# EAGLE design V6.0 (EAGLE 7.6.0)
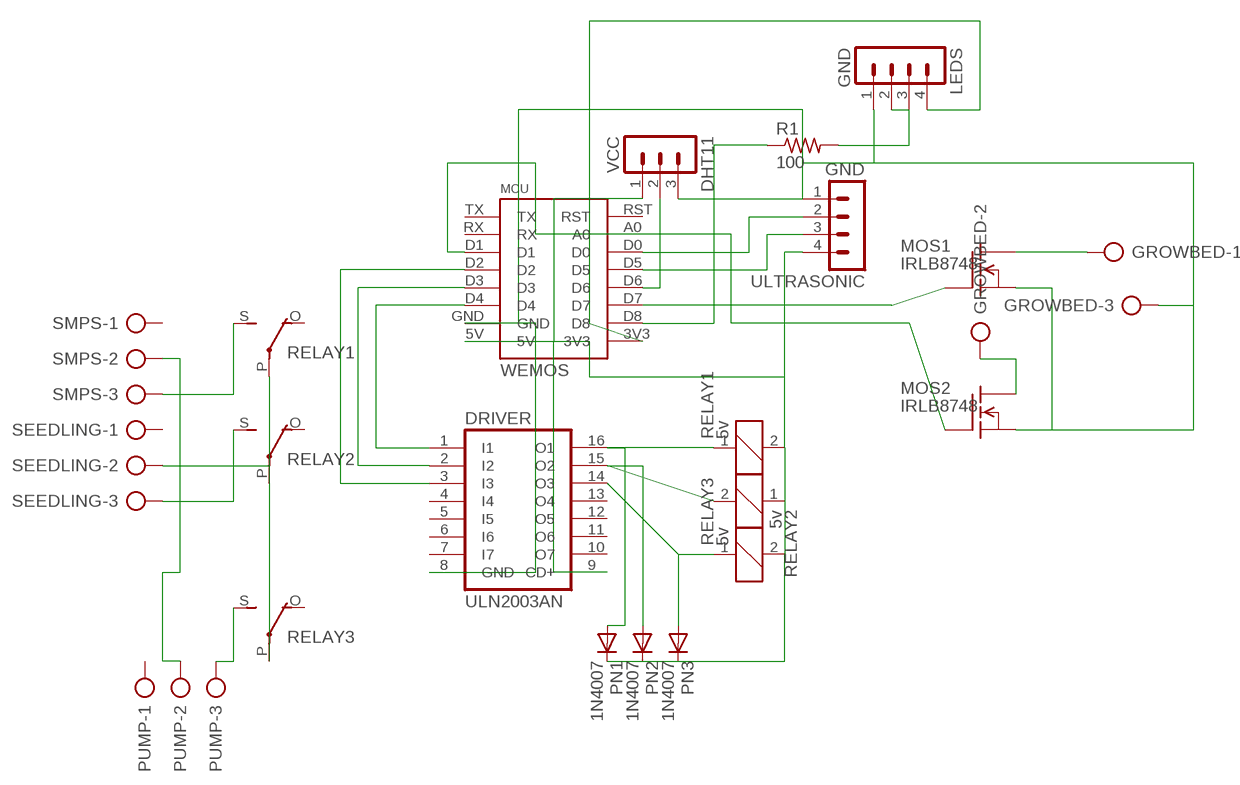
[diagram p0: schematic, sheet 1]

## Parts
DHT11  VCC  MA03-1  [MA03-1]
DRIVER  ULN2003AN  [DIL16]
GROWBED  AK300/3  [AK300/3]
LEDS  GND  MA04-1  [MA04-1]
MCU  WEMOS  [WEMOS]
MOS1  IRLB8748  IRF540  [TO220]
MOS2  IRLB8748  IRF540  [TO220]
PN1  1N4007  1N4004  [DO41-10]
PN2  1N4007  1N4004  [DO41-10]
PN3  1N4007  1N4004  [DO41-10]
PUMP  AK300/3  [AK300/3]
R1  100  R-US_0207/7  [0207/7]
RELAY1  5v  ZF112  [ZF112]
RELAY2  5v  ZF112  [ZF112]
RELAY3  5v  ZF112  [ZF112]
SEEDLING  AK300/3  [AK300/3]
SMPS  AK300/3  [AK300/3]
ULTRASONIC  GND  MA04-1  [MA04-1]

## Nets
N$1: MCU.D5 ULTRASONIC.3
N$2: DRIVER.3(I3) MCU.D2
N$3: DRIVER.2(I2) MCU.D3
N$4: DRIVER.1(I1) MCU.D4
N$5: DHT11.3 DRIVER.8(GND) GROWBED.3 LEDS.1 MCU.GND MOS1.3(S) MOS2.3(S) ULTRASONIC.1
N$6: DHT11.1 DRIVER.9(CD+) MCU.5V PN1.C PN2.C PN3.C RELAY1.2 RELAY2.1 RELAY3.2 ULTRASONIC.4
N$7: DRIVER.15(O2) PN2.A RELAY2.2
N$8: DHT11.2 MCU.D6
N$9: DRIVER.14(O3) PN3.A RELAY3.1
N$10: DRIVER.16(O1) PN1.A RELAY1.1
N$12: RELAY1.S(2:S) SMPS.3
N$13: RELAY2.S(2:S) SEEDLING.3
N$15: PUMP.3 RELAY3.S(2:S)
N$16: PUMP.2 RELAY1.P(2:P) RELAY2.P(2:P) RELAY3.P(2:P) SEEDLING.2 SMPS.2
N$19: MCU.D0 ULTRASONIC.2
N$20: LEDS.4 MCU.3V3
N$21: MCU.D7 MOS1.1(G)
N$22: MCU.D1 MOS2.1(G)
N$24: GROWBED.1 MOS1.2(D)
N$25: GROWBED.2 MOS2.2(D)
N$27: LEDS.2 LEDS.3 R1.2
N$28: MCU.D8 R1.1
Unconnected: DRIVER.4(I4) DRIVER.5(I5) DRIVER.6(I6) DRIVER.7(I7) DRIVER.10(O7) DRIVER.11(O6) DRIVER.12(O5) DRIVER.13(O4) MCU.A0 MCU.RST MCU.RX MCU.TX PUMP.1 RELAY1.O(2:O) RELAY2.O(2:O) RELAY3.O(2:O) SEEDLING.1 SMPS.1

## Library data of the parts
DHT11 = con-lstb:MA03-1: PIN HEADER; OC_FARNELL: unknown; OC_NEWARK: unknown
DRIVER = uln-udn:ULN2003A: DRIVER ARRAY
GROWBED PUMP SEEDLING SMPS = con-ptr500:AK300/3: CONNECTOR; OC_FARNELL: unknown; OC_NEWARK: unknown
LEDS ULTRASONIC = con-lstb:MA04-1: PIN HEADER; OC_FARNELL: unknown; OC_NEWARK: unknown
MCU = Wemos:WEMOS
MOS1 MOS2 = transistor-fet:IRF540: N-Channel Enhancement MOSFET (HEXFET); 100V; 28A; 0,077Ohm
PN1-PN3 = diode:1N4004: DIODE general purpose rectifier, 1 A
R1 = rcl:R-US_: RESISTOR, American symbol
RELAY1-RELAY3 = relay:ZF112: RELAY 1 x switch; OC_FARNELL: unknown; OC_NEWARK: unknown

## Board
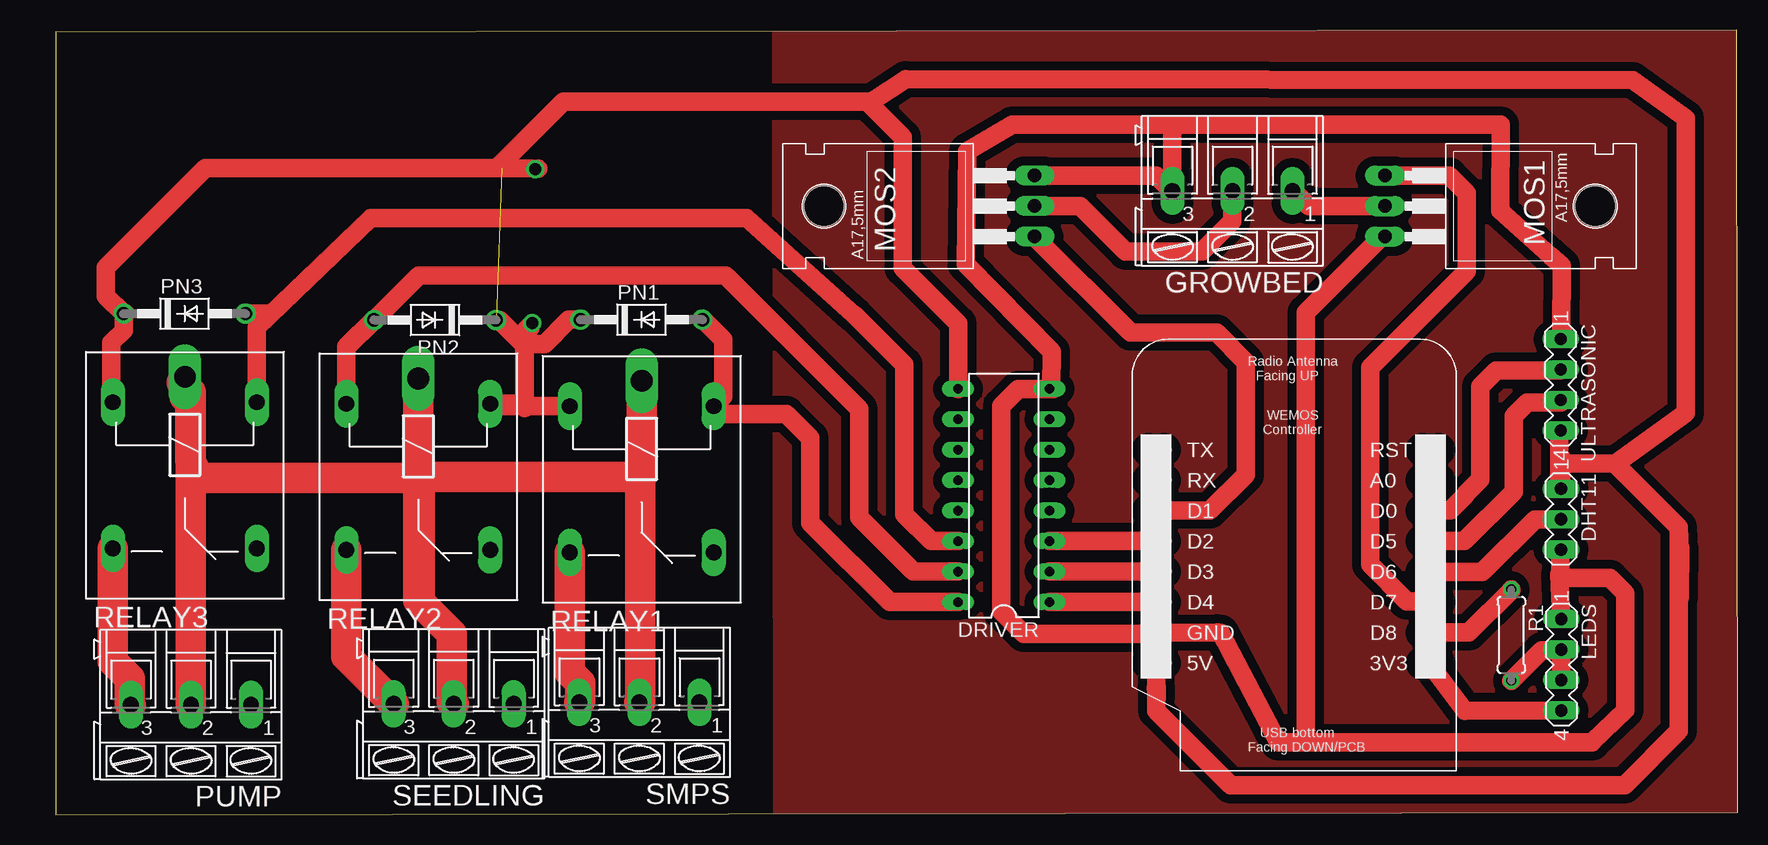
[diagram p1: board, top side]
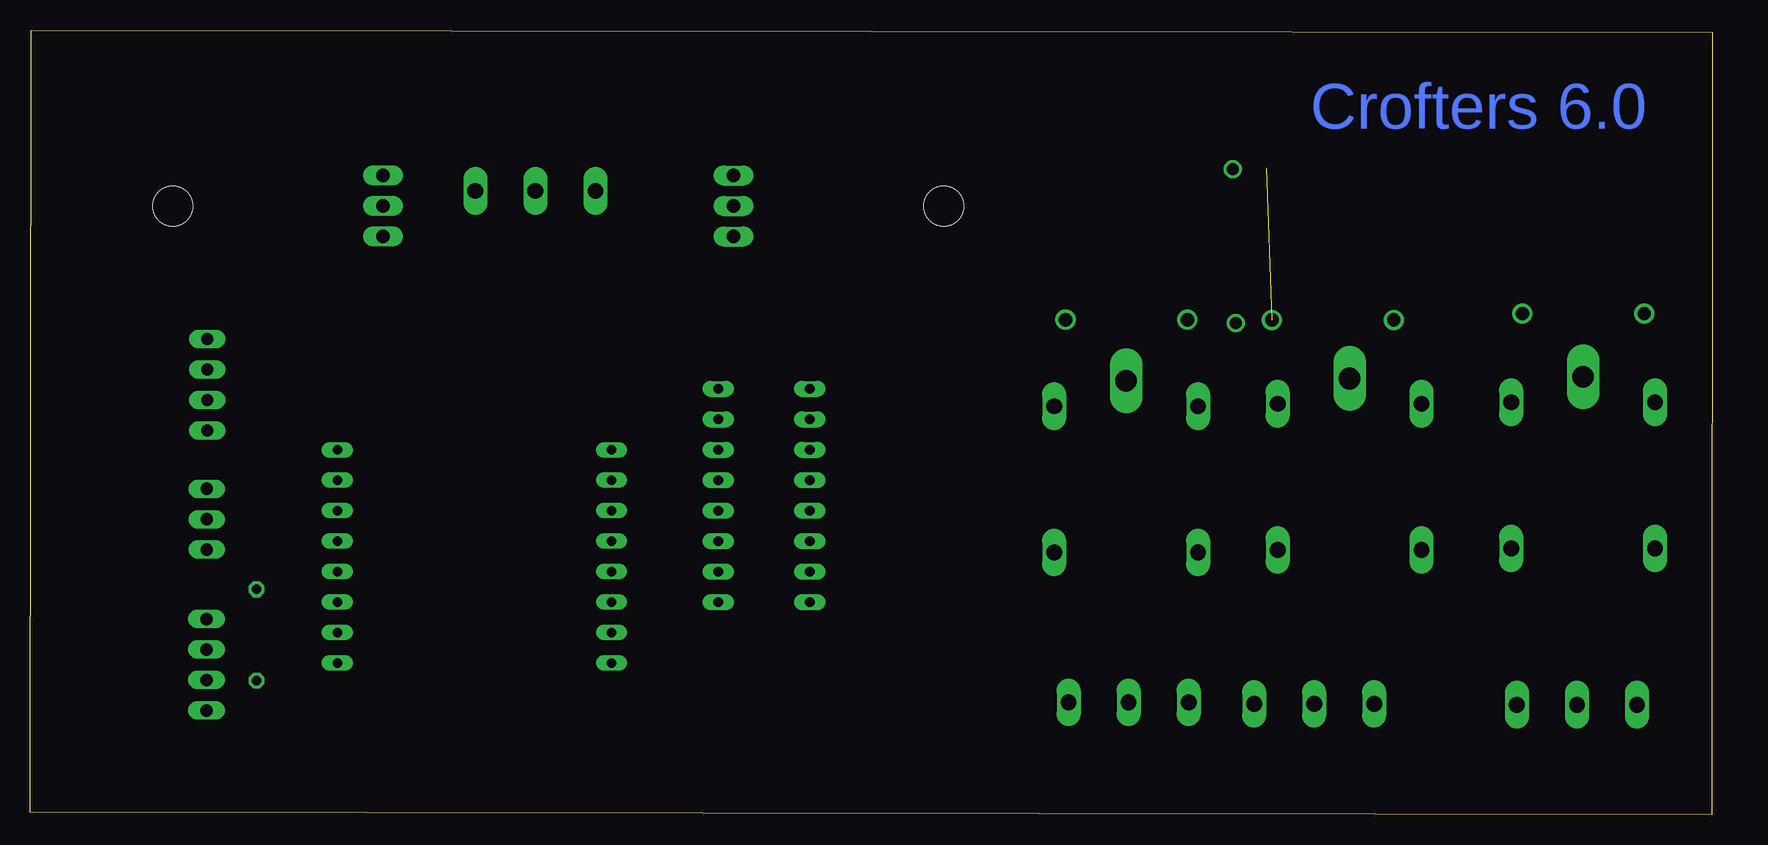
[diagram p2: board, bottom side, seen from below]

Size 140.19 x 65.43 mm. Coordinates in mm from the lower left corner, seen from the top.
Outline: 0.02,0 140.19,0.2 140.09,65.43 0,65.23 0.02,0
Copper layers (1*16): Top 0.035mm / dielectric 1.5mm / Bottom 0.035mm
Design rules "default": minimum track width 60mil, minimum drill 24mil, track to track 30mil, track to pad 35mil, pad to pad 8mil, via to via 8mil, smd to smd 8mil, copper to edge 1mil, drill to drill 20mil, minimum pad ring 10mil, minimum via ring 8mil, stop-mask expansion 4mil, vias tented up to drill 0mil, thermal gap 10mil

### Footprints (pad centres in the part's own frame; a part is rotated, then mirrored left to right if it is on the bottom)
MA03-1 = drill 1.016 long: 1 -2.54,0; 2 0,0; 3 2.54,0
DIL16 = drill 0.813 long: 1 -8.89,-3.81; 2 -6.35,-3.81; 3 -3.81,-3.81; 4 -1.27,-3.81; 5 1.27,-3.81; 6 3.81,-3.81; 7 6.35,-3.81; 8 8.89,-3.81; 9 8.89,3.81; 10 6.35,3.81; 11 3.81,3.81; 12 1.27,3.81; 13 -1.27,3.81; 14 -3.81,3.81; 15 -6.35,3.81; 16 -8.89,3.81
AK300/3 = drill 1.321 long: 1 -5.004,0; 2 0,0; 3 5.004,0
MA04-1 = drill 1.016 long: 1 -3.81,0; 2 -1.27,0; 3 1.27,0; 4 3.81,0
WEMOS = drill 0.8 long: 3V3 22.86,0; 5V 0,0; A0 22.86,15.24; D0 22.86,12.7; D1 0,12.7; D2 0,10.16; D3 0,7.62; D4 0,5.08; D5 22.86,10.16; D6 22.86,7.62; D7 22.86,5.08; D8 22.86,2.54; GND 0,2.54; RST 22.86,17.78; RX 0,15.24; TX 0,17.78
TO220 = drill 1.118 long: 1 -2.54,-6.35; 2 0,-6.35; 3 2.54,-6.35 | hole 3.302: 0,11.176
DO41-10 = drill 1.118: A 5.08,0; C -5.08,0
0207/7 = drill 0.813 octagon: 1 -3.81,0; 2 3.81,0
ZF112 = drill 1.321 long: 1 -6.096,5.994; 2 -6.096,-5.994; O 6.096,5.994; S 6.096,-5.994 | drill 1.803 long: P -8.204,0

### Placement (x,y rotation side)
DHT11  125.45,24.64 270 top
DRIVER  79.02,26.62 90 top
GROWBED  98.07,52.02 180 top
LEDS  125.48,12.5 270 top
MCU  91.72,12.65 0 top
MOS1  117.12,50.75 270 top
MOS2  75.21,50.75 90 top
PN1  48.82,41.28 0 top
PN2  31.62,41.25 180 top
PN3  10.74,41.78 0 top
PUMP  11.28,9.17 180 top
R1  121.31,14.99 270 top
RELAY1  48.84,27.97 270 top
RELAY2  30.23,28.17 270 top
RELAY3  10.77,28.3 270 top
SEEDLING  33.17,9.25 180 top
SMPS  48.64,9.37 180 top
ULTRASONIC  125.43,35.84 270 top

### Tracks (layer width: path | path; a pad name or v marks a point on that pad's centre or on a via)
N$1
  Top 1.524: MCU.D5 117.4,22.81 121.51,26.92 121.51,33.25 122.63,34.37 125.43,34.37 125.6,34.54 125.45,34.54 ULTRASONIC.3
N$2
  Top 1.524: DRIVER.3 MCU.D2
N$3
  Top 1.524: DRIVER.2 MCU.D3
N$4
  Top 1.524: DRIVER.1 MCU.D4
N$5
  Top 0.61: 93.52,57.43 100.41,57.43 100.43,57.45 93.32,57.45 93.12,57.66 93.12,57.53 93.09,57.51 | 93.17,57.53 100.66,57.53 100.69,57.51 100.86,57.51 101.07,57.3 101.07,57.35 100.89,57.53
  Top 1.524: MOS2.3 91.72,53.29 92.99,52.02 GROWBED.3 93.07,57.43 93.17,57.53 | 96.8,15.19 97.08,15.16 | 97.08,15.16 92.28,15.19 | 92.28,15.19 MCU.GND | 93.09,57.53 79.73,57.53 75.97,55.35 75.84,45.92 83.03,38.61 82.98,35.66 83.13,35.51 DRIVER.8 80.24,35.51 78.82,34.09 78.82,16.94 80.67,15.09 92.18,15.09 92.28,15.19 | 93.17,57.53 100.89,57.53 120.42,57.53 120.4,50.37 124.54,46.63 125.53,45.77 125.48,40.06 125.37,39.95 125.37,39.7 ULTRASONIC.1 125.43,39.75 125.45,39.78 125.45,40 125.63,40.18 | 125.25,21.89 DHT11.3 125.37,21.89 125.37,20.35 | 125.37,20.35 125.65,19.79 125.76,19.68 125.81,19.74 129.51,19.74 130.78,18.47 130.78,8.69 128.07,6.07 128.04,6.04 104.42,6.04 | LEDS.1 125.32,20.01 125.37,20.35 | 93.17,57.53 93.09,57.53 | 93.09,57.53 93.04,57.48 93.47,57.48 93.52,57.43 | 97.08,15.16 101.91,6.04 104.42,6.04 | MOS1.3 110.52,48.21 104.17,41.86 104.17,6.3 104.42,6.04
N$6  (1 unrouted)
  Top 1.524: 39.09,39.17 39.09,33.91 38.73,34.26 RELAY2.1 36.42,34.06 RELAY1.2 39.22,34.06 39.06,34.21 39.06,39.57 | 39.09,39.17 39.09,39.24 | 39.09,39.24 39.09,40.13 39.55,40.59 | 125.48,29.77 125.48,29.49 | 125.48,29.49 125.48,27.41 125.3,27.23 | 125.3,27.23 125.3,31.9 ULTRASONIC.4 | DHT11.1 125.35,27.18 125.3,27.23 | 125.48,29.49 125.68,29.29 129.77,29.29 129.82,29.24 129.97,29.24 | 36.98,41.25 37.01,41.25 39.09,39.17 | PN1.C 42.77,41.27 40.74,39.24 39.09,39.24 | DRIVER.9 75.21,40.97 70.61,45.57 70.61,56.49 68.2,58.9 | 68.2,58.9 67.64,59.46 42.32,59.46 36.75,53.9 | 36.75,53.9 12.47,53.9 4.19,45.62 4.19,43.26 PN3.C | PN3.C 5.66,40.39 4.65,39.37 4.65,34.52 RELAY3.2 | 5.84,41.78 PN3.C | 36.75,53.9 37.19,53.9 40.21,53.85 | PN2.C 36.96,41.25 | 36.96,41.25 38.91,39.29 38.91,40.16 39.62,40.87 | 129.97,29.24 135.84,33.48 135.84,58.06 131.44,61.24 70.87,61.34 68.2,59.56 68.2,58.9 | 135.35,21.97 135.25,17.75 135.28,23.4 135.28,6.98 130.76,2.46 97.92,2.46 91.72,8.66 91.72,8.74 | 91.72,10.54 91.72,8.74 | 135.35,21.97 135.25,23.96 129.97,29.24 | MCU.5V 91.72,10.67 | 91.72,10.67 91.72,10.59 | 91.72,10.54 91.69,10.52 91.69,10.57 91.72,10.67 | 135.35,21.97 135.33,18.11 135.38,22.22 | 91.72,8.74 91.75,10.31 91.75,10.62 91.72,10.59 | 36.96,41.25 36.98,41.25 | 36.98,41.25 38.99,39.24 | 91.72,10.54 91.72,10.59
N$7
  Top 1.524: 26.49,41.27 24.23,39.01 RELAY2.2 24.23,38.94 PN2.A 30.25,44.96 55.83,44.96 66.95,33.83 66.95,24.76 71.45,20.27 DRIVER.15
N$8
  Top 1.524: DHT11.2 123.29,24.64 118.9,20.24 114.61,20.24 MCU.D6
N$9
  Top 1.524: RELAY3.1 16.76,40.61 17.74,41.59 | 17.74,41.59 26.26,49.76 57.61,49.76 66.52,41.71 66.57,41.71 70.74,37.54 70.74,25.04 72.97,22.81 DRIVER.14 | PN3.A 17.55,41.78 17.74,41.59
N$10
  Top 1.524: PN1.A 53.97,41.27 55.65,39.6 55.65,34.87 RELAY1.1 55.5,33.4 60.88,33.4 62.89,31.39 62.89,24.33 69.49,17.73 DRIVER.16
N$11
  pour Top: 59.92,65.3 139.93,65.43 140.23,0.36 59.99,0.15
N$12
  Top 2.54: RELAY1.S 42.85,11.86 43.74,10.97 43.74,9.47 SMPS.3
N$13
  Top 2.54: RELAY2.S 24.23,13.18 SEEDLING.3
N$14  (via drill 1)
  other vias: 39.73,41
N$15
  Top 2.54: RELAY3.S 4.78,12.78 6.2,11.35 6.2,9.25 PUMP.3
N$16
  Top 2.54: RELAY2.P 30.23,28.47 | 30.23,28.47 30.23,17.86 | 30.23,17.86 32.99,15.09 32.99,9.42 SEEDLING.2 | 30.23,17.86 30.33,17.86 30.33,28.17 48.72,28.17 | 48.72,28.17 48.84,28.17 RELAY1.P | SMPS.2 48.72,9.37 48.72,28.17 | PUMP.2 11.28,35.25 10.52,36.02 10.77,36.27 RELAY3.P 10.77,34.82 11.23,34.37 11.23,29.51 11.94,28.07 29.39,28.07 30.23,28.47
N$18  (via drill 1)
  other vias: 39.98,53.82
N$19
  Top 1.524: MCU.D0 116.2,25.35 117.48,26.62 117.48,26.7 118.72,27.94 118.72,35.71 120.04,37.03 125.35,37.03 ULTRASONIC.2
N$20
  Top 1.524: LEDS.4 117.45,8.66 114.58,12.45 MCU.3V3
N$21
  Top 1.524: MOS1.1 116.13,53.29 117.58,51.84 117.58,45.31 109.55,37.29 109.55,20.85 112.6,17.81 114.48,17.81 114.68,17.6 114.68,17.63 MCU.D7
N$22
  Top 1.524: MCU.D1 96.19,25.35 99.19,28.35 99.19,37.74 96.75,40.18 89.59,40.18 MOS2.1
N$24
  Top 1.524: MOS1.2 104.42,50.75 103.15,52.02 GROWBED.1
N$25
  Top 1.524: MOS2.2 85.37,50.75 89.18,46.94 95.53,46.94 98.07,49.48 GROWBED.2
N$27
  Top 1.524: LEDS.2 LEDS.3 125.48,13.69 125.45,13.72 123.85,13.72 R1.2
N$28
  Top 1.524: MCU.D8 114.5,15.27 114.5,15.29 114.58,15.21 114.61,15.21 | 114.58,15.04 MCU.D8 | MCU.D8 114.61,15.21 | 114.61,15.21 117.78,15.21 121.29,18.72 121.29,18.77 R1.1

### Text on the board
Bottom: Crofters 6.0